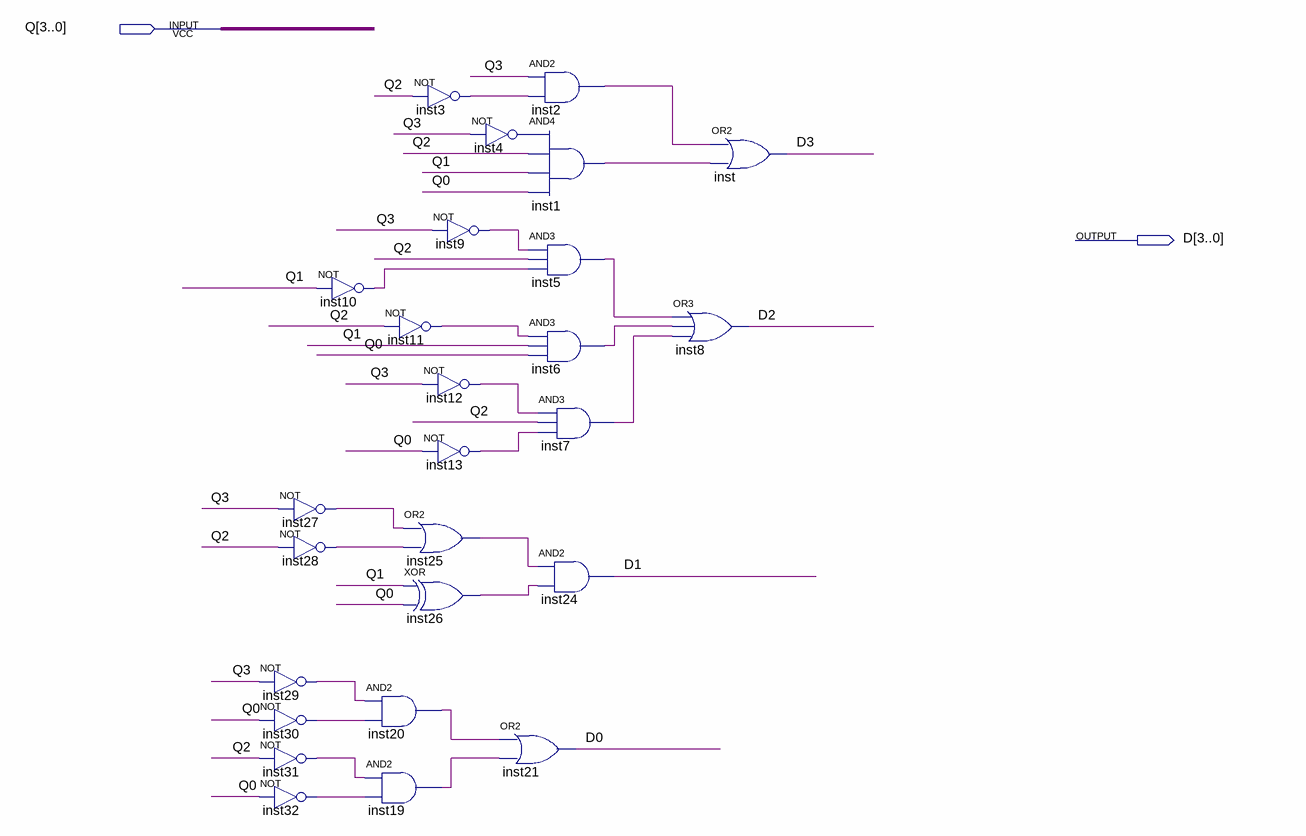
[diagram p0: schematic sheet]
// Quartus schematic NEXTSTATEREAL.bdf as structural Verilog: 26 symbols, 2 pins
module NEXTSTATEREAL (
  input  [3:0] Q,
  output [3:0] D
);

  wire inst1_out, inst2_out, inst3_out, inst4_out, inst5_out, inst6_out, inst7_out, inst9_out, inst10_out,
       inst11_out, inst12_out, inst13_out, inst19_out, inst20_out, inst25_out, inst26_out, inst27_out,
       inst28_out, inst29_out, inst30_out, inst31_out, inst32_out;

  not inst29 (inst29_out, Q[3]);
  not inst30 (inst30_out, Q[0]);
  not inst31 (inst31_out, Q[2]);
  not inst32 (inst32_out, Q[0]);
  not inst10 (inst10_out, Q[1]);
  not inst27 (inst27_out, Q[3]);
  not inst28 (inst28_out, Q[2]);
  not inst3 (inst3_out, Q[2]);
  not inst11 (inst11_out, Q[2]);
  not inst12 (inst12_out, Q[3]);
  not inst13 (inst13_out, Q[0]);
  or inst25 (inst25_out, inst27_out, inst28_out);
  xor inst26 (inst26_out, Q[1], Q[0]);
  and inst20 (inst20_out, inst29_out, inst30_out);
  and inst19 (inst19_out, inst31_out, inst32_out);
  not inst4 (inst4_out, Q[3]);
  not inst9 (inst9_out, Q[3]);
  or inst21 (D[0], inst20_out, inst19_out);
  and inst2 (inst2_out, Q[3], inst3_out);
  and inst1 (inst1_out, inst4_out, Q[2], Q[1], Q[0]);
  and inst5 (inst5_out, inst9_out, Q[2], inst10_out);
  and inst6 (inst6_out, inst11_out, Q[1], Q[0]);
  and inst7 (inst7_out, inst12_out, Q[2], inst13_out);
  and inst24 (D[1], inst25_out, inst26_out);
  or inst (D[3], inst2_out, inst1_out);
  or inst8 (D[2], inst5_out, inst6_out, inst7_out);
endmodule
